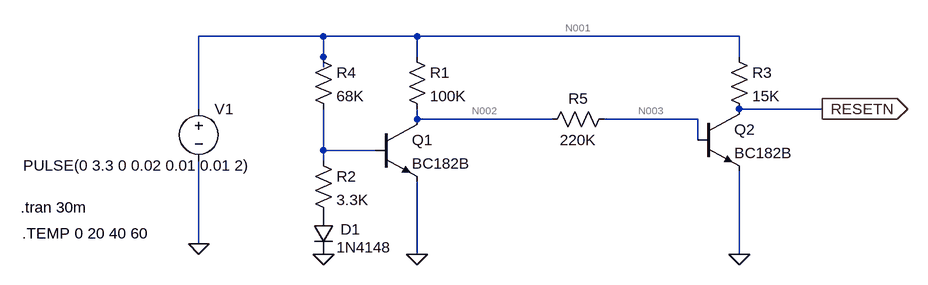
[diagram p0: schematic ESP32VoltageSupervisor.asc]
ESP32VoltageSupervisor.asc, the LTspice schematic file:
Version 4
SHEET 1 992 680
WIRE 64 -64 -128 -64
WIRE 208 -64 64 -64
WIRE 704 -64 208 -64
WIRE 64 -32 64 -64
WIRE 208 -32 208 -64
WIRE 704 -32 704 -64
WIRE 64 -16 64 -32
WIRE -128 48 -128 -64
WIRE 832 48 704 48
WIRE 208 64 208 48
WIRE 416 64 208 64
WIRE 640 64 496 64
WIRE 640 96 640 64
WIRE 64 112 64 48
WIRE 144 112 64 112
WIRE 64 128 64 112
WIRE -128 256 -128 128
WIRE 208 272 208 160
WIRE 704 272 704 144
FLAG -128 256 0
FLAG 208 272 0
FLAG 832 48 RESETN
IOPIN 832 48 Out
FLAG 704 272 0
FLAG 64 272 0
SYMBOL npn 144 64 R0
SYMATTR InstName Q1
SYMATTR Value BC182B
SYMBOL voltage -128 32 R0
WINDOW 3 -270 103 Left 2
WINDOW 123 0 0 Left 0
WINDOW 39 0 0 Left 0
SYMATTR InstName V1
SYMATTR Value PULSE(0 3.3 0 0.02 0.01 0.01 2)
SYMBOL res 192 -48 R0
SYMATTR InstName R1
SYMATTR Value 100K
SYMBOL npn 640 48 R0
SYMATTR InstName Q2
SYMATTR Value BC182B
SYMBOL res 688 -48 R0
SYMATTR InstName R3
SYMATTR Value 15K
SYMBOL res 512 48 R90
WINDOW 0 0 56 VBottom 2
WINDOW 3 32 56 VTop 2
SYMATTR InstName R5
SYMATTR Value 220K
SYMBOL res 48 -48 R0
SYMATTR InstName R4
SYMATTR Value 68K
SYMBOL res 48 112 R0
SYMATTR InstName R2
SYMATTR Value 3.3K
SYMBOL diode 48 208 R0
WINDOW 0 42 26 Left 2
WINDOW 3 36 53 Left 2
SYMATTR InstName D1
SYMATTR Value 1N4148
TEXT -402 200 Left 2 !.tran 30m
TEXT -400 240 Left 2 !.TEMP 0 20 40 60

The netlist it stands for:
* ESP32VoltageSupervisor.asc
Q1 N002 N004 0 0 BC182B
V1 N001 0 PULSE(0 3.3 0 0.02 0.01 0.01 2)
R1 N001 N002 100K
Q2 RESETN N003 0 0 BC182B
R3 N001 RESETN 15K
R5 N003 N002 220K
R4 N001 N004 68K
R2 N004 P001 3.3K
D1 P001 0 1N4148
.model D D
.lib standard.dio
.model NPN NPN
.model PNP PNP
.lib standard.bjt
.tran 30m
.TEMP 0 20 40 60
.backanno
.end

* Results of the author's LTspice run, read from the files saved beside the schematic
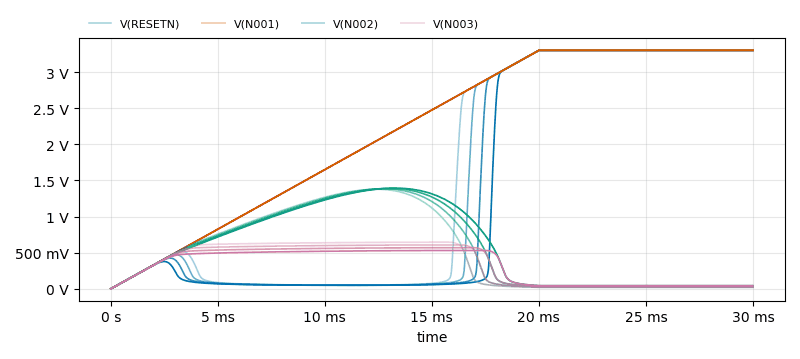
[diagram p1: Transient Analysis of ESP32VoltageSupervisor.asc, plotted from the saved traces]
* Transient Analysis, 4 runs:
*   V(RESETN) [temp=0°C]: min 0 V, max 3.3 V, average 1.551 V, rms 2.186 V, last 3.3 V
*   V(RESETN) [temp=20°C]: min 0 V, max 3.3 V, average 1.494 V, rms 2.152 V, last 3.3 V
*   V(RESETN) [temp=40°C]: min 0 V, max 3.3 V, average 1.437 V, rms 2.116 V, last 3.3 V
*   V(RESETN) [temp=60°C]: min 0 V, max 3.3 V, average 1.38 V, rms 2.079 V, last 3.3 V
*   V(N001) [temp=0°C]: min 0 V, max 3.3 V, average 2.2 V, rms 2.46 V, last 3.3 V
*   V(N001) [temp=20°C]: min 0 V, max 3.3 V, average 2.2 V, rms 2.46 V, last 3.3 V
*   V(N001) [temp=40°C]: min 0 V, max 3.3 V, average 2.2 V, rms 2.46 V, last 3.3 V
*   V(N001) [temp=60°C]: min 0 V, max 3.3 V, average 2.2 V, rms 2.46 V, last 3.3 V
*   V(N002) [temp=0°C]: min 0 V, max 1.378 V, average 517.5 mV, rms 739.2 mV, last 20.53 mV
*   V(N002) [temp=20°C]: min 0 V, max 1.384 V, average 538.1 mV, rms 754.6 mV, last 25.99 mV
*   V(N002) [temp=40°C]: min 0 V, max 1.389 V, average 558.1 mV, rms 768.6 mV, last 33.28 mV
*   V(N002) [temp=60°C]: min 0 V, max 1.393 V, average 577.7 mV, rms 781.4 mV, last 43.3 mV
*   V(N003) [temp=0°C]: min 0 V, max 645.4 mV, average 323.3 mV, rms 433.4 mV, last 20.53 mV
*   V(N003) [temp=20°C]: min 0 V, max 607.4 mV, average 318.8 mV, rms 417 mV, last 25.99 mV
*   V(N003) [temp=40°C]: min 0 V, max 569.1 mV, average 312.7 mV, rms 398.7 mV, last 33.28 mV
*   V(N003) [temp=60°C]: min 0 V, max 530.7 mV, average 305.3 mV, rms 378.8 mV, last 43.3 mV